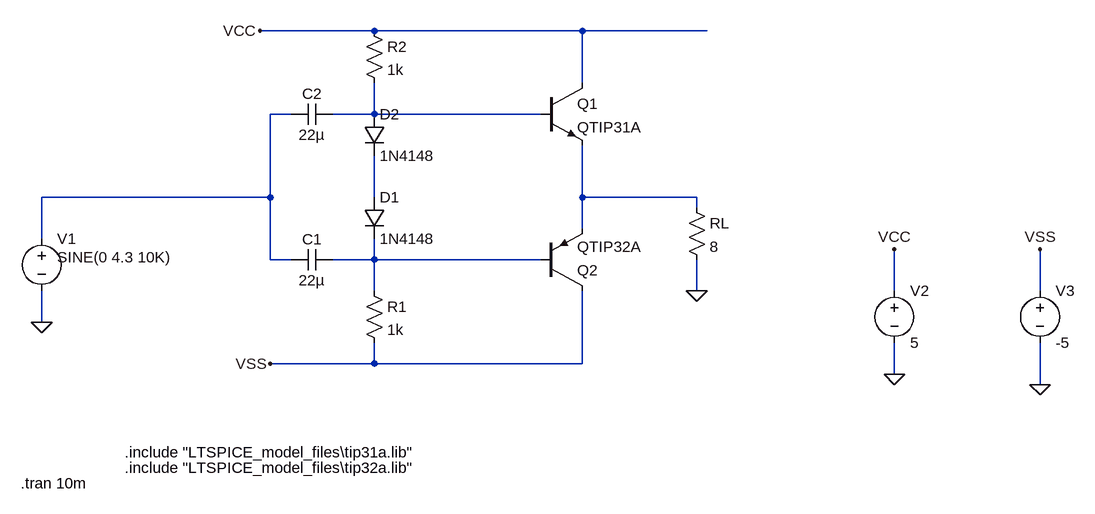
[diagram p0: schematic Power Amplifier.asc]
Power Amplifier.asc, the LTspice schematic file:
Version 4.1
SHEET 1 1128 680
WIRE 48 -160 -128 -160
WIRE 368 -160 48 -160
WIRE 560 -160 368 -160
WIRE 368 -80 368 -160
WIRE -80 -32 -112 -32
WIRE 48 -32 48 -80
WIRE 48 -32 -16 -32
WIRE 304 -32 48 -32
WIRE -112 96 -112 -32
WIRE -112 96 -464 96
WIRE 48 96 48 32
WIRE 368 96 368 16
WIRE 544 96 368 96
WIRE 544 112 544 96
WIRE 368 144 368 96
WIRE -464 160 -464 96
WIRE -112 192 -112 96
WIRE -80 192 -112 192
WIRE 48 192 48 160
WIRE 48 192 -16 192
WIRE 304 192 48 192
WIRE 48 240 48 192
WIRE 544 240 544 192
WIRE 848 240 848 176
WIRE 1072 240 1072 176
WIRE -464 288 -464 240
WIRE 48 352 48 320
WIRE 48 352 -112 352
WIRE 368 352 368 240
WIRE 368 352 48 352
WIRE 848 368 848 320
WIRE 1072 384 1072 320
FLAG -128 -160 VCC
FLAG -112 352 VSS
FLAG -464 288 0
FLAG 544 240 0
FLAG 848 368 0
FLAG 848 176 VCC
FLAG 1072 176 VSS
FLAG 1072 384 0
SYMBOL npn 304 -80 R0
SYMATTR InstName Q1
SYMATTR Value QTIP31A
SYMBOL diode 32 96 R0
SYMATTR InstName D1
SYMATTR Value 1N4148
SYMBOL diode 32 -32 R0
SYMATTR InstName D2
SYMATTR Value 1N4148
SYMBOL pnp 304 240 M180
SYMATTR InstName Q2
SYMATTR Value QTIP32A
SYMBOL cap -16 176 R90
WINDOW 0 0 32 VBottom 2
WINDOW 3 32 32 VTop 2
SYMATTR InstName C1
SYMATTR Value 22µ
SYMBOL cap -16 -48 R90
WINDOW 0 0 32 VBottom 2
WINDOW 3 32 32 VTop 2
SYMATTR InstName C2
SYMATTR Value 22µ
SYMBOL res 32 224 R0
SYMATTR InstName R1
SYMATTR Value 1k
SYMBOL res 32 -176 R0
SYMATTR InstName R2
SYMATTR Value 1k
SYMBOL voltage -464 144 R0
WINDOW 3 24 44 Left 2
WINDOW 123 0 0 Left 0
WINDOW 39 0 0 Left 0
SYMATTR Value SINE(0 4.3 10K)
SYMATTR InstName V1
SYMBOL res 528 96 R0
SYMATTR InstName RL
SYMATTR Value 8
SYMBOL voltage 848 224 R0
SYMATTR InstName V2
SYMATTR Value 5
SYMBOL voltage 1072 224 R0
WINDOW 123 0 0 Left 0
WINDOW 39 0 0 Left 0
SYMATTR InstName V3
SYMATTR Value -5
TEXT -336 488 Left 2 !.include "LTSPICE_model_files\\tip31a.lib"
TEXT -336 512 Left 2 !.include "LTSPICE_model_files\\tip32a.lib"
TEXT -496 536 Left 2 !.tran 10m

The netlist it stands for:
* Power Amplifier.asc
Q1 VCC N002 N004 0 QTIP31A
D1 N003 N005 1N4148
D2 N002 N003 1N4148
Q2 VSS N005 N004 0 QTIP32A
C1 N005 N001 22µ
C2 N002 N001 22µ
R1 N005 VSS 1k
R2 VCC N002 1k
V1 N001 0 SINE(0 4.3 10K)
RL N004 0 8
V2 VCC 0 5
V3 VSS 0 -5
.model D D
.lib standard.dio
.model NPN NPN
.model PNP PNP
.lib standard.bjt
.include "LTSPICE_model_files\tip31a.lib"
.include "LTSPICE_model_files\tip32a.lib"
.tran 10m
.backanno
.end